# EAGLE design pins (EAGLE 6.4)
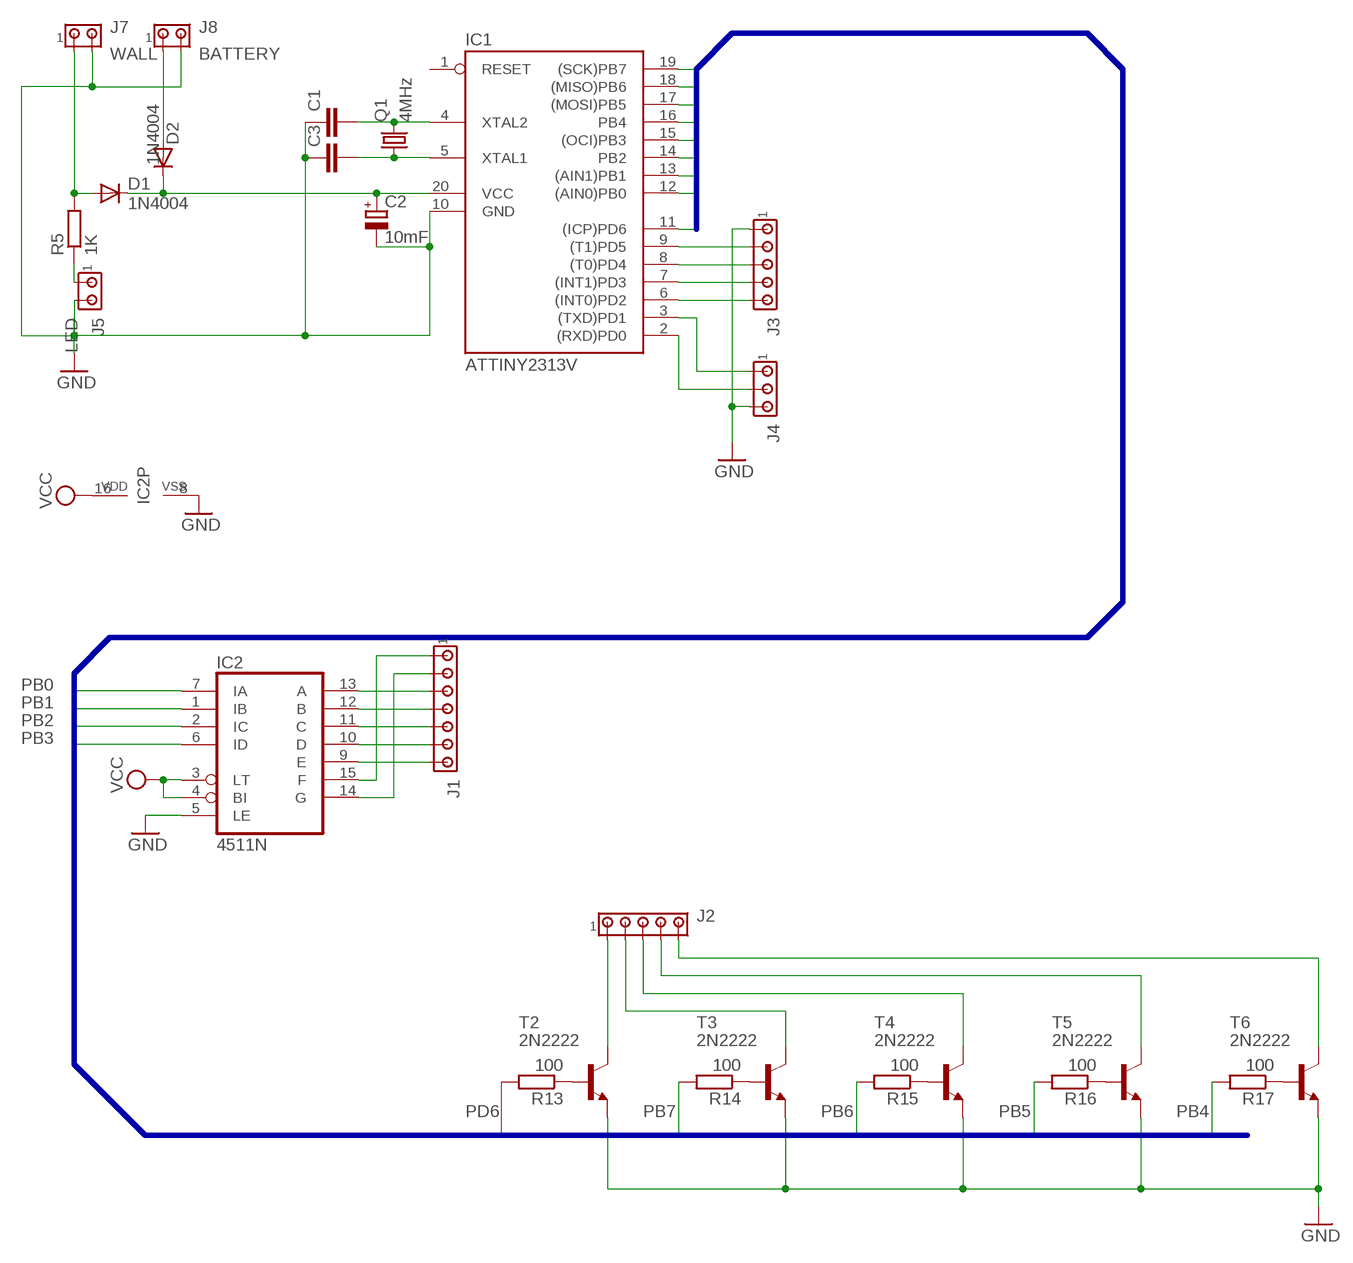
[diagram p0: schematic, sheet 1]

## Parts
C1  C-EU025-025X050  [C025-025X050]
C2  10mF  CPOL-EUE2.5-6  [E2,5-6]
C3  C-EU025-025X050  [C025-025X050]
D1  1N4004  [DO41-10]
D2  1N4004  [DO41-10]
IC1  ATTINY2313V  AT90S2313P  [DIL20]
IC2  4511N  [DIL16]
J1  MTA07-100  [10X07MTA]
J2  MTA05-100  [10X05MTA]
J3  MTA05-100  [10X05MTA]
J4  MTA03-100  [10X03MTA]
J5  LED  MTA02-100  [10X02MTA]
J7  WALL  MTA02-100  [10X02MTA]
J8  BATTERY  MTA02-100  [10X02MTA]
Q1  4MHz  CRYSTALHC49U70  [HC49U70]
R5  1K  R-EU_0207/10  [0207/10]
R13  100  R-EU_0207/10  [0207/10]
R14  100  R-EU_0207/10  [0207/10]
R15  100  R-EU_0207/10  [0207/10]
R16  100  R-EU_0207/10  [0207/10]
R17  100  R-EU_0207/10  [0207/10]
T2  2N2222  [TO18]
T3  2N2222  [TO18]
T4  2N2222  [TO18]
T5  2N2222  [TO18]
T6  2N2222  [TO18]

## Nets
GND: C1.1 C2.- C3.1 IC1.10(GND) IC2.5(LE) IC2.8(VSS) J3.1 J4.3 J5.2 J7.2 J8.2 T2.1(E) T3.1(E) T4.1(E) T5.1(E) T6.1(E)
N$1: IC1.9((T1)PD5) J3.2
N$2: D1.A J7.1 R5.2
N$3: IC2.13(A) J1.3
N$4: IC2.12(B) J1.4
N$5: C3.2 IC1.5(XTAL1) Q1.1
N$6: IC1.8((T0)PD4) J3.3
N$7: IC1.7((INT1)PD3) J3.4
N$8: IC1.6((INT0)PD2) J3.5
N$9: IC1.2((RXD)PD0) J4.2
N$10: IC1.3((TXD)PD1) J4.1
N$11: C1.2 IC1.4(XTAL2) Q1.2
N$12: D2.A J8.1
N$13: J2.1 T2.3(C)
N$14: J2.2 T3.3(C)
N$15: IC2.11(C) J1.5
N$16: IC2.10(D) J1.6
N$17: IC2.9(E) J1.7
N$18: IC2.15(F) J1.1
N$19: IC2.14(G) J1.2
N$20: J5.1 R5.1
N$22: J2.3 T4.3(C)
N$23: J2.4 T5.3(C)
N$24: J2.5 T6.3(C)
N$30: R13.1 T2.2(B)
N$31: R14.1 T3.2(B)
N$32: R15.1 T4.2(B)
N$33: R16.1 T5.2(B)
N$34: R17.1 T6.2(B)
PB0: IC1.12((AIN0)PB0) IC2.7(IA)
PB1: IC1.13((AIN1)PB1) IC2.1(IB)
PB2: IC1.14(PB2) IC2.2(IC)
PB3: IC1.15((OCI)PB3) IC2.6(ID)
PB4: IC1.16(PB4) R17.2
PB5: IC1.17((MOSI)PB5) R16.2
PB6: IC1.18((MISO)PB6) R15.2
PB7: IC1.19((SCK)PB7) R14.2
PD6: IC1.11((ICP)PD6) R13.2
VCC: C2.+ D1.C D2.C IC1.20(VCC) IC2.3(LT) IC2.4(BI) IC2.16(VDD)
Unconnected: IC1.1(RESET)

## Buses
PB[0..7],PD6

## Library data of the parts
C1 C3 = resistor:C-EU: CAPACITOR, European symbol
C2 = rcl:CPOL-EU: POLARIZED CAPACITOR, European symbol
D1 D2 = diode:1N4004: DIODE general purpose rectifier, 1 A
IC1 = atmel:AT90S2313: MICROCONTROLLER 2 Kbytes FLASH 128 bytes SRAM 128 bytes EEPROM UART; OC_FARNELL: unknown; OC_NEWARK: unknown
IC2 = 45xx:4511: BCD to 7-segment LATCH/DECODER/DRIVER
J1 = con-amp:MTA07-100: AMP connector
J2 J3 = con-amp:MTA05-100: AMP connector
J4 = con-amp:MTA03-100: AMP connector
J5 J7 J8 = con-amp:MTA02-100: AMP connector
Q1 = crystal:CRYSTAL: CRYSTAL; OC_FARNELL: unknown; OC_NEWARK: unknown
R5 R13-R17 = rcl:R-EU_: RESISTOR, European symbol
T2-T6 = transistor:2N2222: NPN TRANSISTOR

## Net classes
0 default: width 1.016 mm, clearance 1.016 mm

## Board
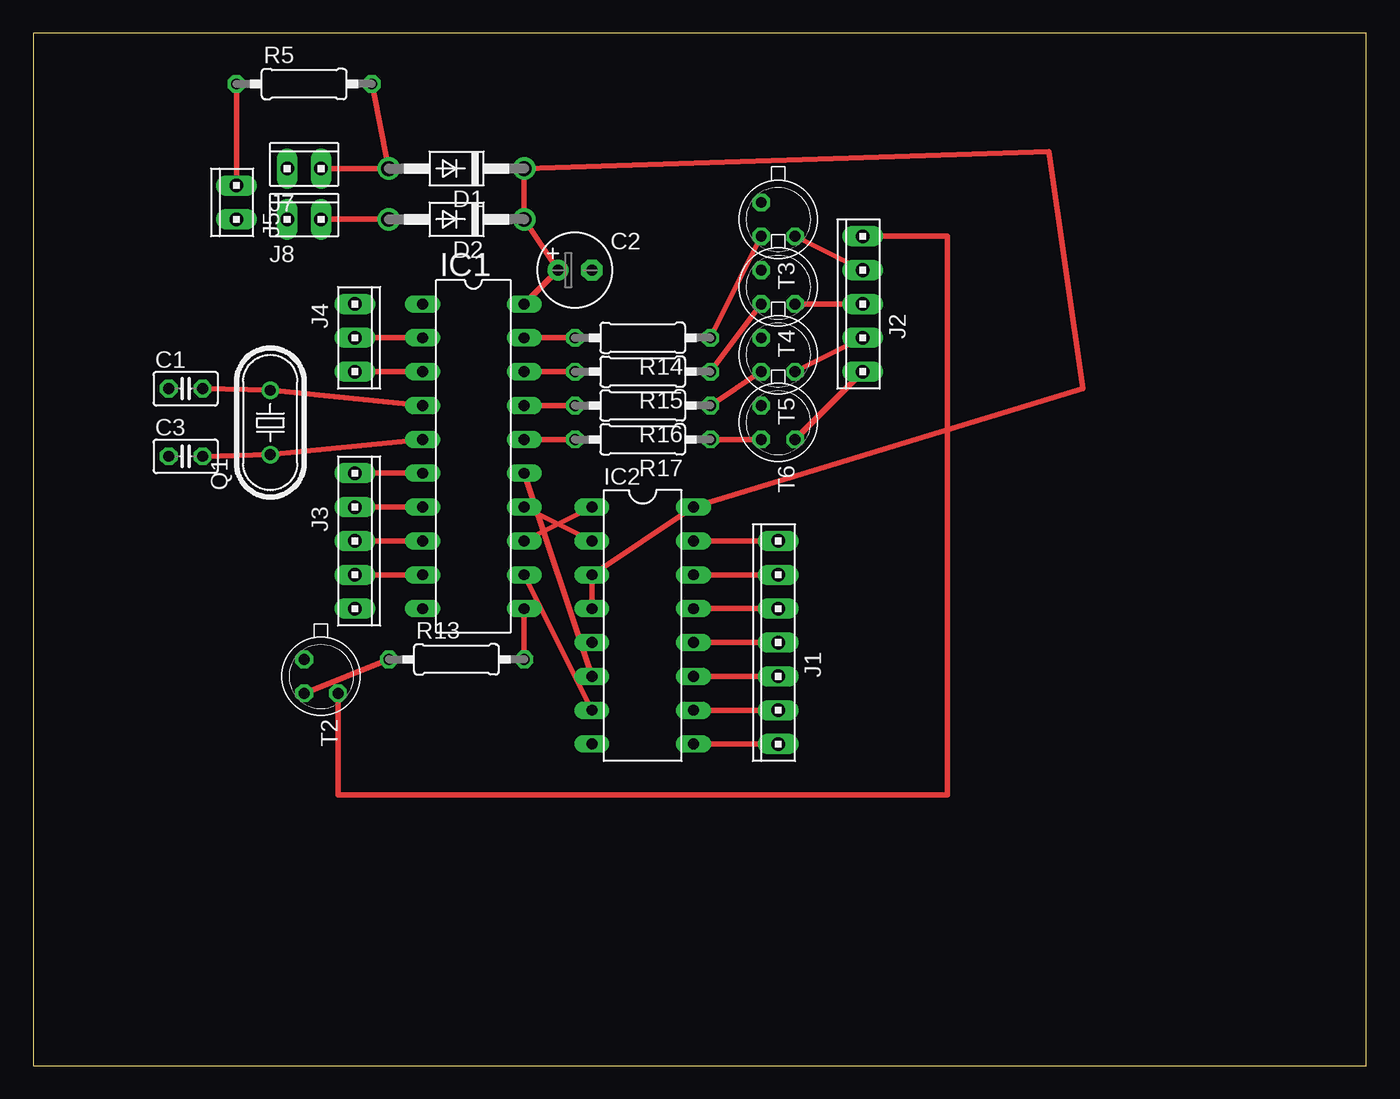
[diagram p1: board, top side]
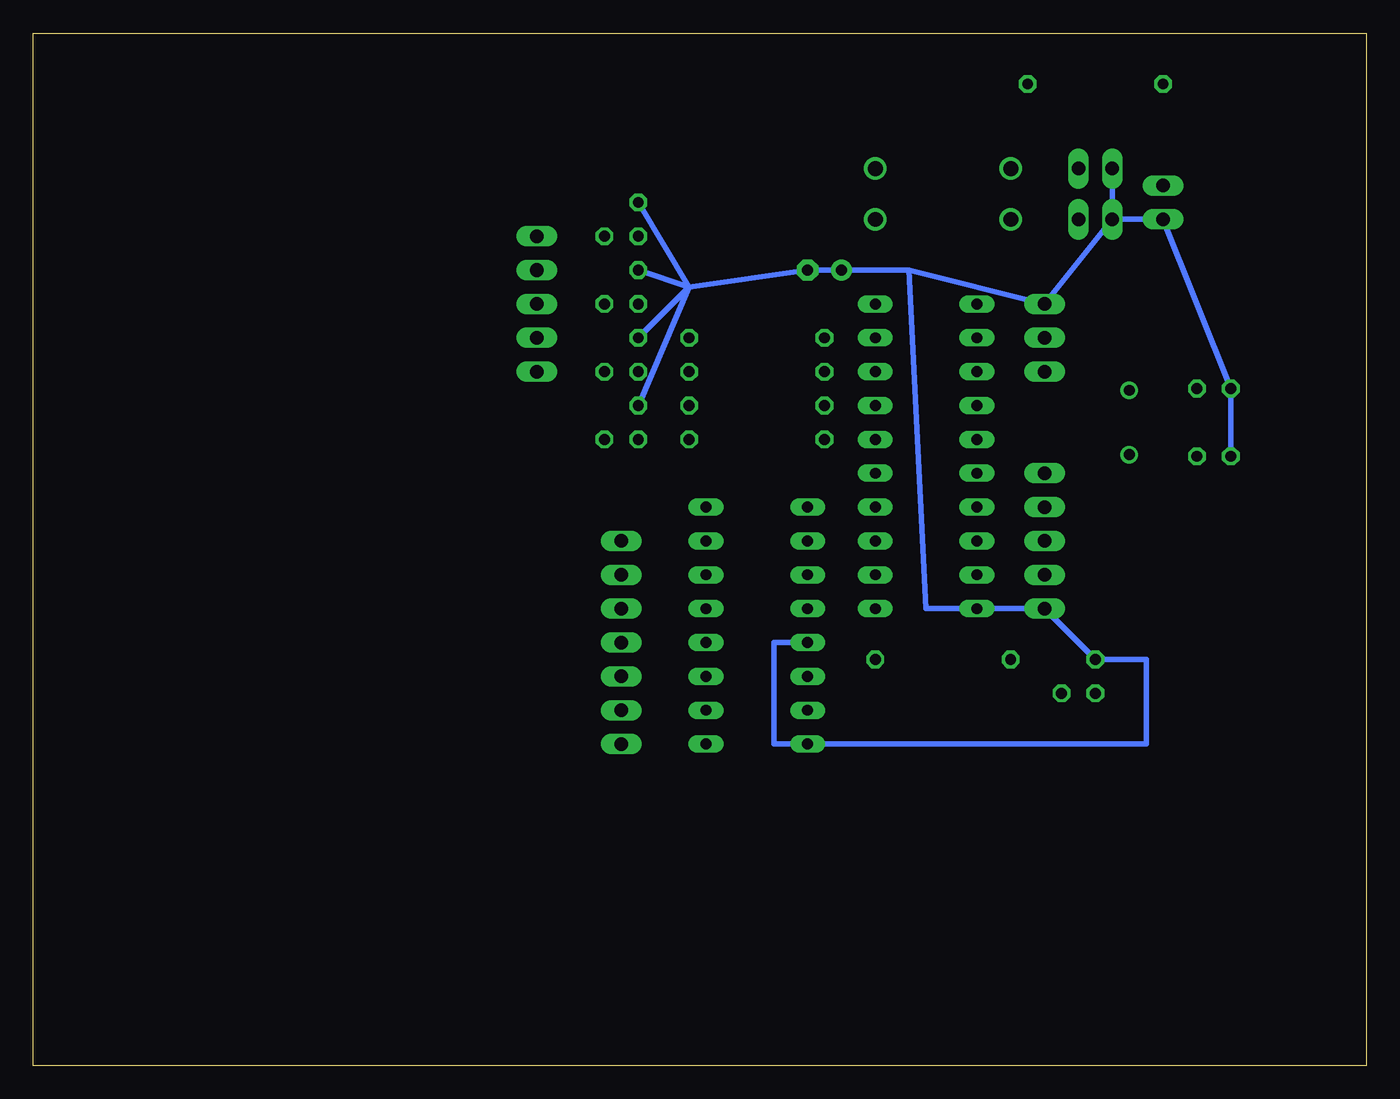
[diagram p2: board, bottom side, seen from below]

Size 100 x 77.46 mm. Coordinates in mm from the lower left corner, seen from the top.
Outline: 0,0 100,0 100,77.46 0,77.46 0,0
Copper layers (1*16): Top 0.035mm / dielectric 1.5mm / Bottom 0.035mm
Design rules "default": minimum track width 10mil, minimum drill 24mil, track to track 8mil, track to pad 8mil, pad to pad 8mil, via to via 8mil, smd to smd 8mil, copper to edge 40mil, drill to drill 8mil, minimum pad ring 10mil, minimum via ring 8mil, stop-mask expansion 4mil, vias tented up to drill 0mil, thermal gap 10mil

### Footprints (pad centres in the part's own frame; a part is rotated, then mirrored left to right if it is on the bottom)
C025-025X050 = drill 0.813 octagon: 1 -1.27,0; 2 1.27,0
E2,5-6 = drill 0.813 pad 1.6: + -1.27,0 | drill 0.813 pad 1.6 octagon: - 1.27,0
DO41-10 = drill 1.118: A 5.08,0; C -5.08,0
DIL20 = drill 0.813 long: 1 -11.43,-3.81; 2 -8.89,-3.81; 3 -6.35,-3.81; 4 -3.81,-3.81; 5 -1.27,-3.81; 6 1.27,-3.81; 7 3.81,-3.81; 8 6.35,-3.81; 9 8.89,-3.81; 10 11.43,-3.81; 11 11.43,3.81; 12 8.89,3.81; 13 6.35,3.81; 14 3.81,3.81; 15 1.27,3.81; 16 -1.27,3.81; 17 -3.81,3.81; 18 -6.35,3.81; 19 -8.89,3.81; 20 -11.43,3.81
DIL16 = drill 0.813 long: 1 -8.89,-3.81; 2 -6.35,-3.81; 3 -3.81,-3.81; 4 -1.27,-3.81; 5 1.27,-3.81; 6 3.81,-3.81; 7 6.35,-3.81; 8 8.89,-3.81; 9 8.89,3.81; 10 6.35,3.81; 11 3.81,3.81; 12 1.27,3.81; 13 -1.27,3.81; 14 -3.81,3.81; 15 -6.35,3.81; 16 -8.89,3.81
10X07MTA = drill 1.016 long: 1 7.62,0; 2 5.08,0; 3 2.54,0; 4 0,0; 5 -2.54,0; 6 -5.08,0; 7 -7.62,0
10X05MTA = drill 1.016 long: 1 5.08,0; 2 2.54,0; 3 0,0; 4 -2.54,0; 5 -5.08,0
10X03MTA = drill 1.016 long: 1 2.54,0; 2 0,0; 3 -2.54,0
10X02MTA = drill 1.016 long: 1 1.27,0; 2 -1.27,0
HC49U70 = drill 0.813: 1 -2.413,0; 2 2.413,0
0207/10 = drill 0.813 octagon: 1 -5.08,0; 2 5.08,0
TO18 = drill 0.813 octagon: 1 -1.27,-1.27; 2 1.27,-1.27; 3 1.27,1.27

### Placement (x,y rotation side)
C1  11.43,50.8 0 top
C2  40.64,59.69 0 top
C3  11.43,45.72 0 top
D1  31.75,67.31 180 top
D2  31.75,63.5 180 top
IC1  33.02,45.72 270 top
IC2  45.72,33.02 270 top
J1  55.88,31.75 90 top
J2  62.23,57.15 90 top
J3  24.13,39.37 270 top
J4  24.13,54.61 270 top
J5  15.24,64.77 90 top
J7  20.32,67.31 0 top
J8  20.32,63.5 0 top
Q1  17.78,48.26 90 top
R5  20.32,73.66 0 top
R13  31.75,30.48 0 top
R14  45.72,54.61 180 top
R15  45.72,52.07 180 top
R16  45.72,49.53 180 top
R17  45.72,46.99 180 top
T2  21.59,29.21 270 top
T3  55.88,63.5 270 top
T4  55.88,58.42 270 top
T5  55.88,53.34 270 top
T6  55.88,48.26 270 top

### Tracks (layer width: path | path; a pad name or v marks a point on that pad's centre or on a via)
GND
  Bottom 0.406: 34.29,59.69 C2.- 50.8,58.42 | 34.29,59.69 33.02,34.29 IC1.10 J3.1 T2.1 16.51,30.48 16.51,24.13 IC2.8 44.45,24.13 44.45,31.75 IC2.5 | C3.1 C1.1 J5.2 J8.2 | J8.2 J7.2 | J8.2 J4.3 34.29,59.69 | 50.8,58.42 T3.1 | 50.8,58.42 T4.1 | T5.1 50.8,58.42 | T6.1 50.8,58.42
N$1
  Top 0.406: IC1.9 J3.2
N$2
  Top 0.406: J7.1 D1.A R5.2
N$3
  Top 0.406: IC2.13 J1.3
N$4
  Top 0.406: IC2.12 J1.4
N$5
  Top 0.406: IC1.5 Q1.1 C3.2
N$6
  Top 0.406: IC1.8 J3.3
N$7
  Top 0.406: J3.4 IC1.7
N$8
  Top 0.406: IC1.6 J3.5
N$9
  Top 0.406: J4.2 IC1.2
N$10
  Top 0.406: J4.1 IC1.3
N$11
  Top 0.406: IC1.4 Q1.2 C1.2
N$12
  Top 0.406: J8.1 D2.A
N$13
  Top 0.406: J2.1 68.58,62.23 68.58,20.32 22.86,20.32 T2.3
N$14
  Top 0.406: J2.2 T3.3
N$15
  Top 0.406: IC2.11 J1.5
N$16
  Top 0.406: IC2.10 J1.6
N$17
  Top 0.406: IC2.9 J1.7
N$18
  Top 0.406: IC2.15 J1.1
N$19
  Top 0.406: IC2.14 J1.2
N$20
  Top 0.406: R5.1 J5.1
N$22
  Top 0.406: J2.3 T4.3
N$23
  Top 0.406: J2.4 T5.3
N$24
  Top 0.406: J2.5 T6.3
N$30
  Top 0.406: R13.1 T2.2
N$31
  Top 0.406: T3.2 R14.1
N$32
  Top 0.406: R15.1 T4.2
N$33
  Top 0.406: R16.1 T5.2
N$34
  Top 0.406: R17.1 T6.2
PB0
  Top 0.406: IC1.12 IC2.7
PB1
  Top 0.406: IC1.13 IC2.1
PB2
  Top 0.406: IC1.14 IC2.2
PB3
  Top 0.406: IC1.15 IC2.6
PB4
  Top 0.406: IC1.16 R17.2
PB5
  Top 0.406: IC1.17 R16.2
PB6
  Top 0.406: IC1.18 R15.2
PB7
  Top 0.406: IC1.19 R14.2
PD6
  Top 0.406: IC1.11 R13.2
VCC
  Top 0.406: IC1.20 C2.+ D2.C D1.C 76.2,68.58 78.74,50.8 IC2.16 IC2.3 IC2.4